# EAGLE design UnknownSchematic (EAGLE 7.6.0)

## Sheet 1 of 3
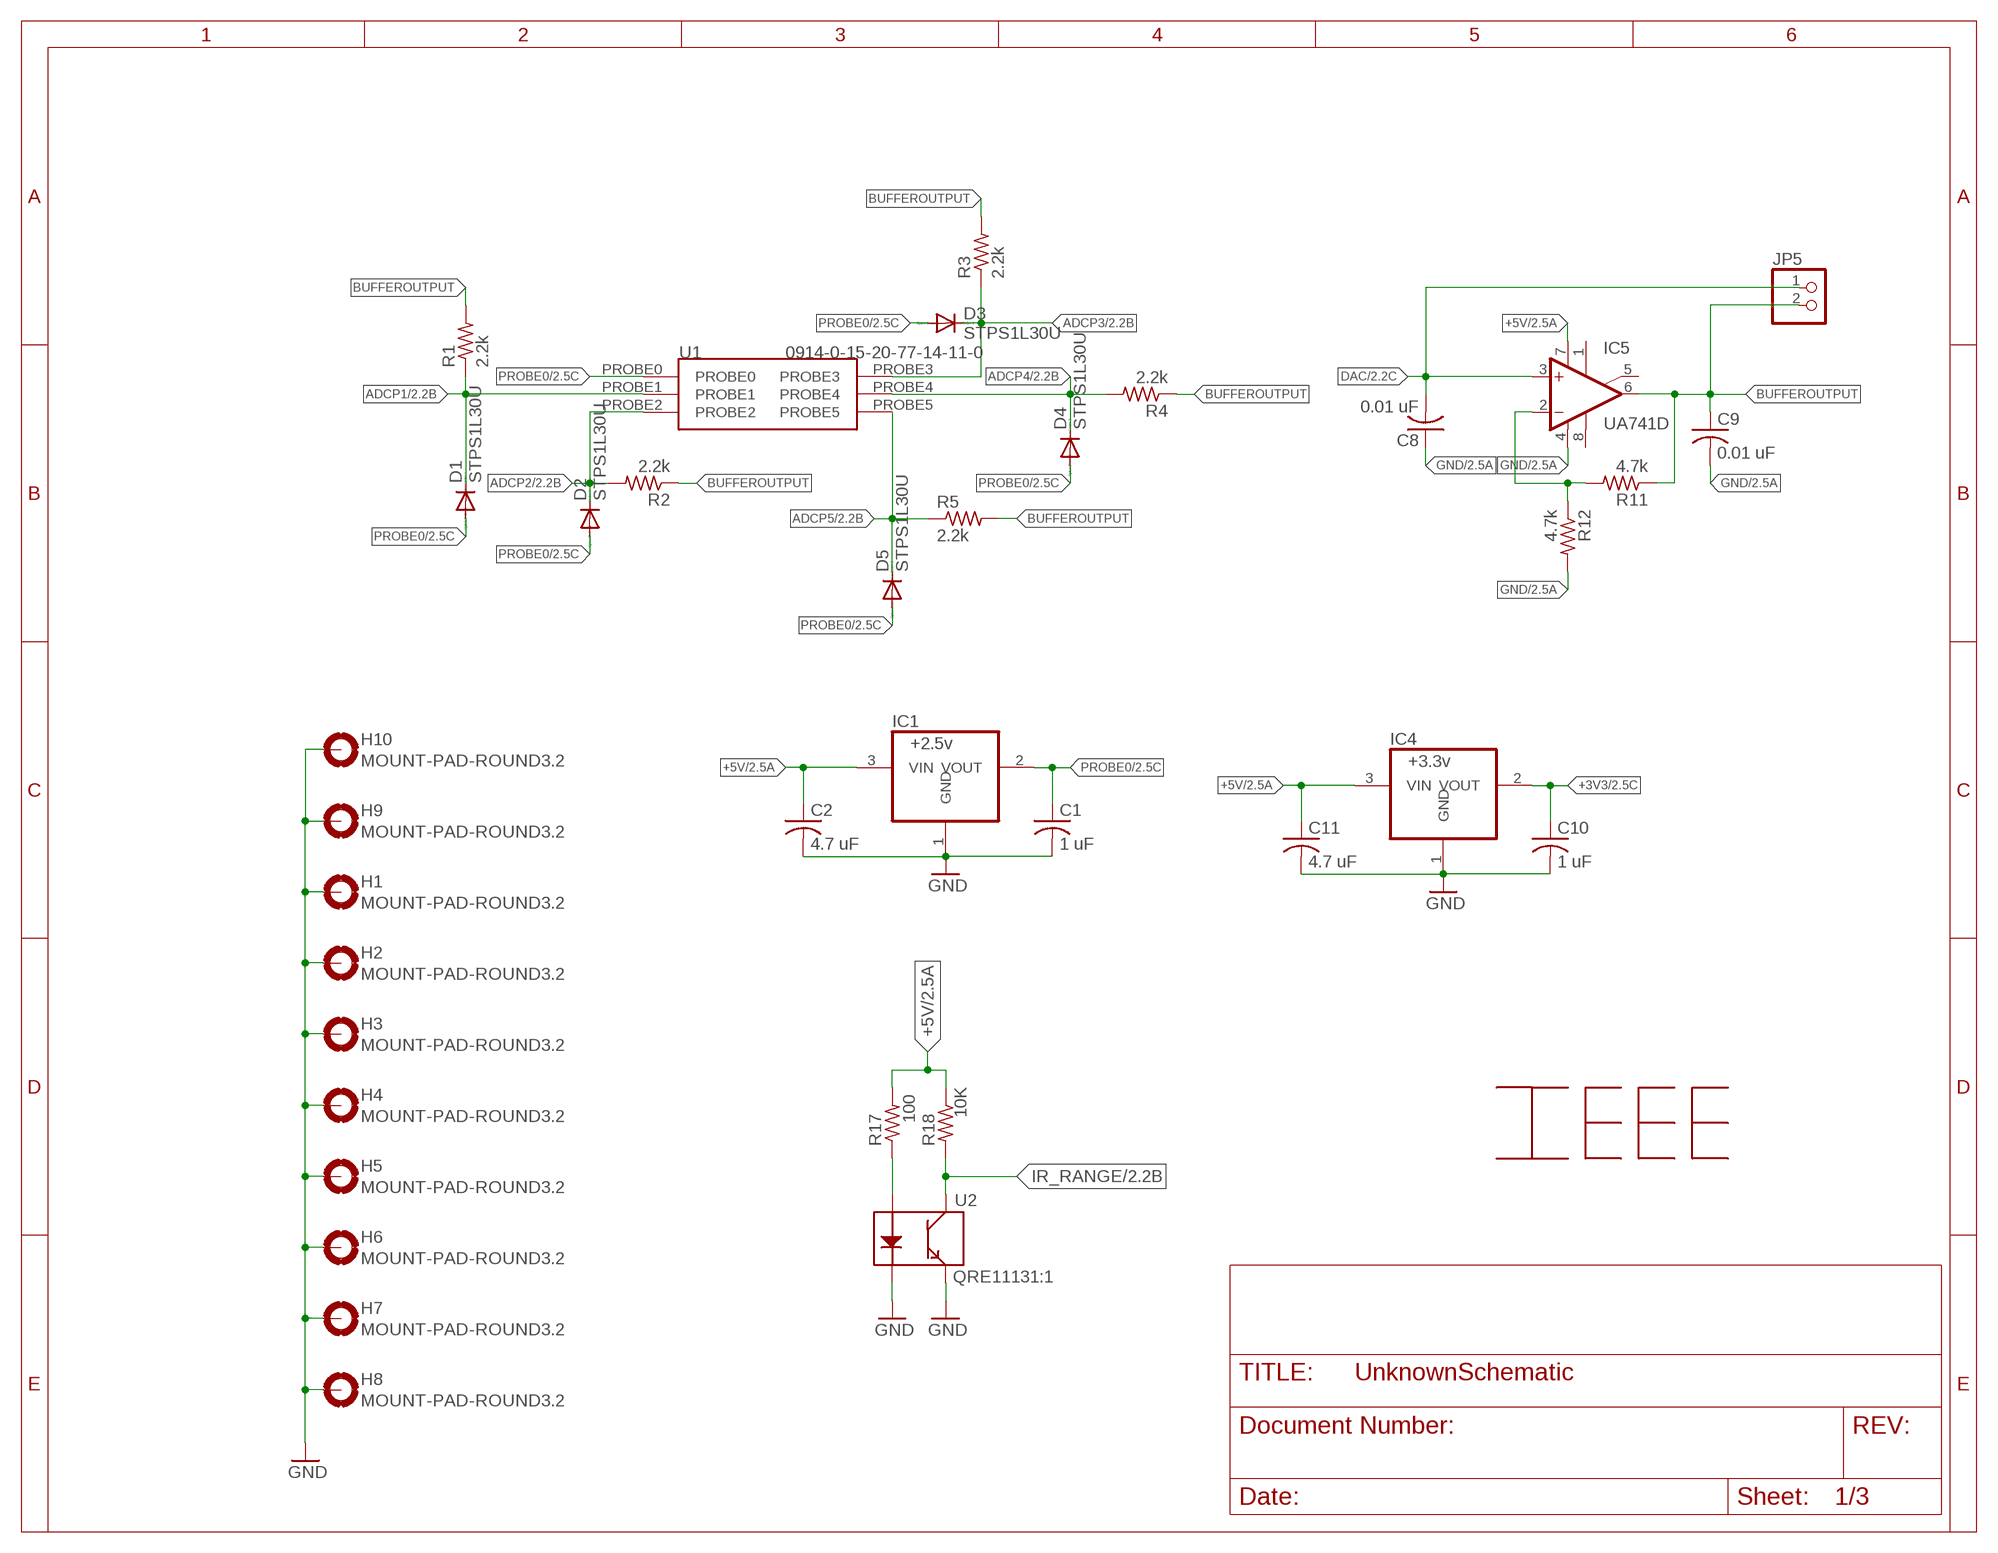
[diagram p0: schematic, sheet 1]

### Parts
C1  1 uF  C-USC0805  [C0805]
C2  4.7 uF  C-USC0805  [C0805]
C8  0.01 uF  C-USC0805  [C0805]
C9  0.01 uF  C-USC0805  [C0805]
C10  1 uF  C-USC0805  [C0805]
C11  4.7 uF  C-USC0805  [C0805]
D1  STPS1L30U  DIODE-DO214AA  [DO214AA]
D2  STPS1L30U  DIODE-DO214AA  [DO214AA]
D3  STPS1L30U  DIODE-DO214AA  [DO214AA]
D4  STPS1L30U  DIODE-DO214AA  [DO214AA]
D5  STPS1L30U  DIODE-DO214AA  [DO214AA]
H1  MOUNT-PAD-ROUND3.2  [3,2-PAD]
H2  MOUNT-PAD-ROUND3.2  [3,2-PAD]
H3  MOUNT-PAD-ROUND3.2  [3,2-PAD]
H4  MOUNT-PAD-ROUND3.2  [3,2-PAD]
H5  MOUNT-PAD-ROUND3.2  [3,2-PAD]
H6  MOUNT-PAD-ROUND3.2  [3,2-PAD]
H7  MOUNT-PAD-ROUND3.2  [3,2-PAD]
H8  MOUNT-PAD-ROUND3.2  [3,2-PAD]
H9  MOUNT-PAD-ROUND3.2  [3,2-PAD]
H10  MOUNT-PAD-ROUND3.2  [3,2-PAD]
IC1  +2.5v  REG1117  [SOT223]
IC4  +3.3v  REG1117  [SOT223]
IC5  UA741D  [SO08]
JP5  PINHD-1X2  [1X02]
R1  2.2k  R-US_R0805  [R0805]
R2  2.2k  R-US_R0805  [R0805]
R3  2.2k  R-US_R0805  [R0805]
R4  2.2k  R-US_R0805  [R0805]
R5  2.2k  R-US_R0805  [R0805]
R11  4.7k  R-US_R0805  [R0805]
R12  4.7k  R-US_R0805  [R0805]
R17  100  R-US_R0805  [R0805]
R18  10K  R-US_R0805  [R0805]
U1  0914-0-15-20-77-14-11-0  STAGE1PROBEMOUNT  [HOLE]
U2  QRE11131:1  [QRE1113-1:1]
U$1  LOGO  [IEEE-LOGO]

### Nets
+3V3: C10.1 IC4.2(VOUT) ; also sheet 2,3
+5V: C2.1 C11.1 IC1.3(VIN) IC4.3(VIN) IC5.7(V+) R17.2 R18.1 ; also sheet 2,3
ADCP1: D1.C R1.1 U1.PROBE1 ; also sheet 2
ADCP2: D2.C R2.2 U1.PROBE2 ; also sheet 2
ADCP3: D3.C R3.1 U1.PROBE3 ; also sheet 2
ADCP4: D4.C R4.2 U1.PROBE4 ; also sheet 2
ADCP5: D5.C R5.1 U1.PROBE5 ; also sheet 2
BUFFEROUTPUT: C9.1 IC5.6(OUT) JP5.2 R1.2 R2.1 R3.2 R4.1 R5.2 R11.1
DAC: C8.2 IC5.3(+IN) JP5.1 ; also sheet 2
GND: C1.2 C2.2 C8.1 C9.2 C10.2 C11.2 H1.B3,2(MOUNT) H2.B3,2(MOUNT) H3.B3,2(MOUNT) H4.B3,2(MOUNT) H5.B3,2(MOUNT) H6.B3,2(MOUNT) H7.B3,2(MOUNT) H8.B3,2(MOUNT) H9.B3,2(MOUNT) H10.B3,2(MOUNT) IC1.1(GND) IC4.1(GND) IC5.4(V-) R12.2 U2.2(K) U2.4(E) ; also sheet 2,3
IR_RANGE: R18.2 U2.3(C) ; also sheet 2
N$2: IC5.2(-IN) R11.2 R12.1
N$12: R17.1 U2.1(A)
PROBE0: C1.1 D1.A D2.A D3.A D4.A D5.A IC1.2(VOUT) U1.PROBE0 ; also sheet 2
Unconnected: IC5.1(ON1) IC5.5(ON2) IC5.8(OPT)

## Sheet 2 of 3
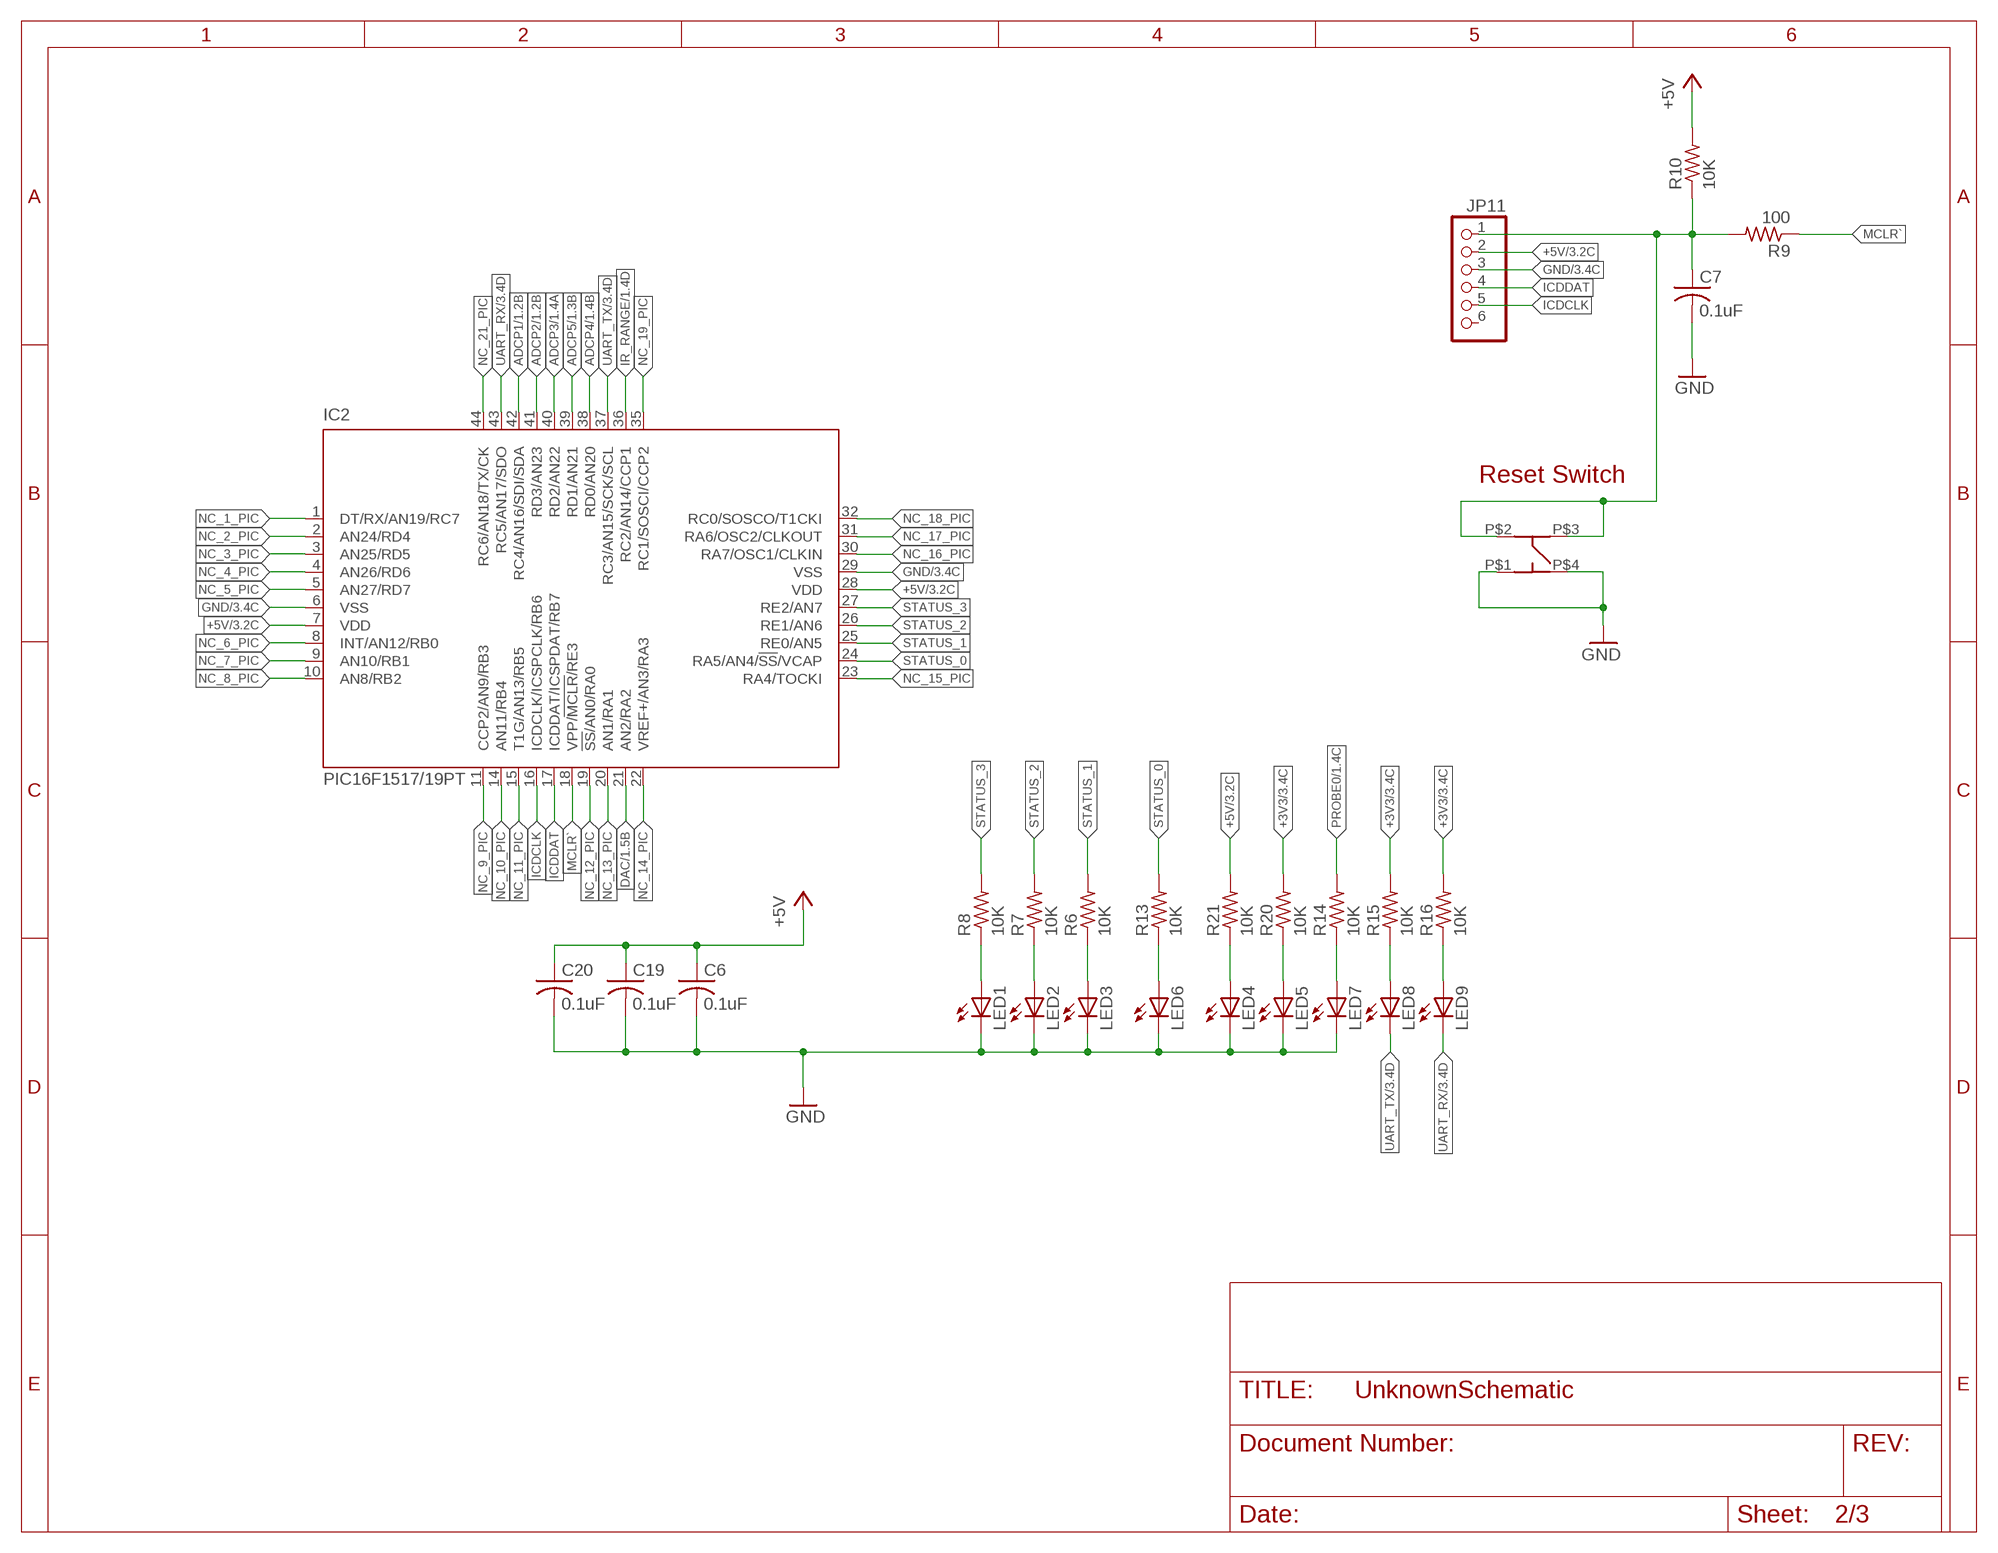
[diagram p1: schematic, sheet 2]

### Parts
C6  0.1uF  C-USC0805  [C0805]
C7  0.1uF  C-USC0805  [C0805]
C19  0.1uF  C-USC0805  [C0805]
C20  0.1uF  C-USC0805  [C0805]
IC2  PIC16F1517/19PT  [TQFP44]
JP11  PINHD-1X6/90  [1X06/90]
LED1  LEDSML0603  [SML0603]
LED2  LEDSML0603  [SML0603]
LED3  LEDSML0603  [SML0603]
LED4  LEDSML0603  [SML0603]
LED5  LEDSML0603  [SML0603]
LED6  LEDSML0603  [SML0603]
LED7  LEDSML0603  [SML0603]
LED8  LEDSML0603  [SML0603]
LED9  LEDSML0603  [SML0603]
R6  10K  R-US_R0805  [R0805]
R7  10K  R-US_R0805  [R0805]
R8  10K  R-US_R0805  [R0805]
R9  100  R-US_R1206  [R1206]
R10  10K  R-US_R1206  [R1206]
R13  10K  R-US_R0805  [R0805]
R14  10K  R-US_R0805  [R0805]
R15  10K  R-US_R0805  [R0805]
R16  10K  R-US_R0805  [R0805]
R20  10K  R-US_R0805  [R0805]
R21  10K  R-US_R0805  [R0805]
TOUCH_RESET  RESET  MC32882_SW  [MC32882_FINAL]

### Nets
+3V3: R15.2 R16.2 R20.2 ; also sheet 1,3
+5V: C6.1 C19.1 C20.1 IC2.7(VDD) IC2.28(VDD) JP11.2 R10.2 R21.2 ; also sheet 1,3
ADCP1: IC2.42(RC4/AN16/SDI/SDA) ; also sheet 1
ADCP2: IC2.41(RD3/AN23) ; also sheet 1
ADCP3: IC2.40(RD2/AN22) ; also sheet 1
ADCP4: IC2.38(RD0/AN20) ; also sheet 1
ADCP5: IC2.39(RD1/AN21) ; also sheet 1
DAC: IC2.21(AN2/RA2) ; also sheet 1
GND: C6.2 C7.2 C19.2 C20.2 IC2.6(VSS) IC2.29(VSS) JP11.3 LED1.C LED2.C LED3.C LED4.C LED5.C LED6.C LED7.C TOUCH_RESET.P$1(P1) TOUCH_RESET.P$4(P4) ; also sheet 1,3
ICDCLK: IC2.16(ICDCLK/ICSPCLK/RB6) JP11.5
ICDDAT: IC2.17(ICDDAT/ICSPDAT/RB7) JP11.4
IR_RANGE: IC2.36(RC2/AN14/CCP1) ; also sheet 1
MCLR: C7.1 JP11.1 R9.2 R10.1 TOUCH_RESET.P$2(P2) TOUCH_RESET.P$3(P3)
MCLR`: IC2.18(VPP/!MCLR!/RE3) R9.1
N$1: LED3.A R6.1
N$3: LED6.A R13.1
N$4: LED7.A R14.1
N$5: LED5.A R20.1
N$6: LED2.A R7.1
N$7: LED1.A R8.1
N$8: LED4.A R21.1
N$10: LED8.A R15.1
N$11: LED9.A R16.1
NC_1_PIC: IC2.1(DT/RX/AN19/RC7)
NC_2_PIC: IC2.2(AN24/RD4)
NC_3_PIC: IC2.3(AN25/RD5)
NC_4_PIC: IC2.4(AN26/RD6)
NC_5_PIC: IC2.5(AN27/RD7)
NC_6_PIC: IC2.8(INT/AN12/RB0)
NC_7_PIC: IC2.9(AN10/RB1)
NC_8_PIC: IC2.10(AN8/RB2)
NC_9_PIC: IC2.11(CCP2/AN9/RB3)
NC_10_PIC: IC2.14(AN11/RB4)
NC_11_PIC: IC2.15(T1G/AN13/RB5)
NC_12_PIC: IC2.19(!SS!/AN0/RA0)
NC_13_PIC: IC2.20(AN1/RA1)
NC_14_PIC: IC2.22(VREF+/AN3/RA3)
NC_15_PIC: IC2.23(RA4/TOCKI)
NC_16_PIC: IC2.30(RA7/OSC1/CLKIN)
NC_17_PIC: IC2.31(RA6/OSC2/CLKOUT)
NC_18_PIC: IC2.32(RC0/SOSCO/T1CKI)
NC_19_PIC: IC2.35(RC1/SOSCI/CCP2)
NC_21_PIC: IC2.44(RC6/AN18/TX/CK)
PROBE0: R14.2 ; also sheet 1
STATUS_0: IC2.24(RA5/AN4/!SS!/VCAP) R13.2
STATUS_1: IC2.25(RE0/AN5) R6.2
STATUS_2: IC2.26(RE1/AN6) R7.2
STATUS_3: IC2.27(RE2/AN7) R8.2
UART_RX: IC2.43(RC5/AN17/SDO) LED9.C ; also sheet 3
UART_TX: IC2.37(RC3/AN15/SCK/SCL) LED8.C ; also sheet 3
Unconnected: JP11.6

### Notes on the sheet
- Reset Switch

## Sheet 3 of 3
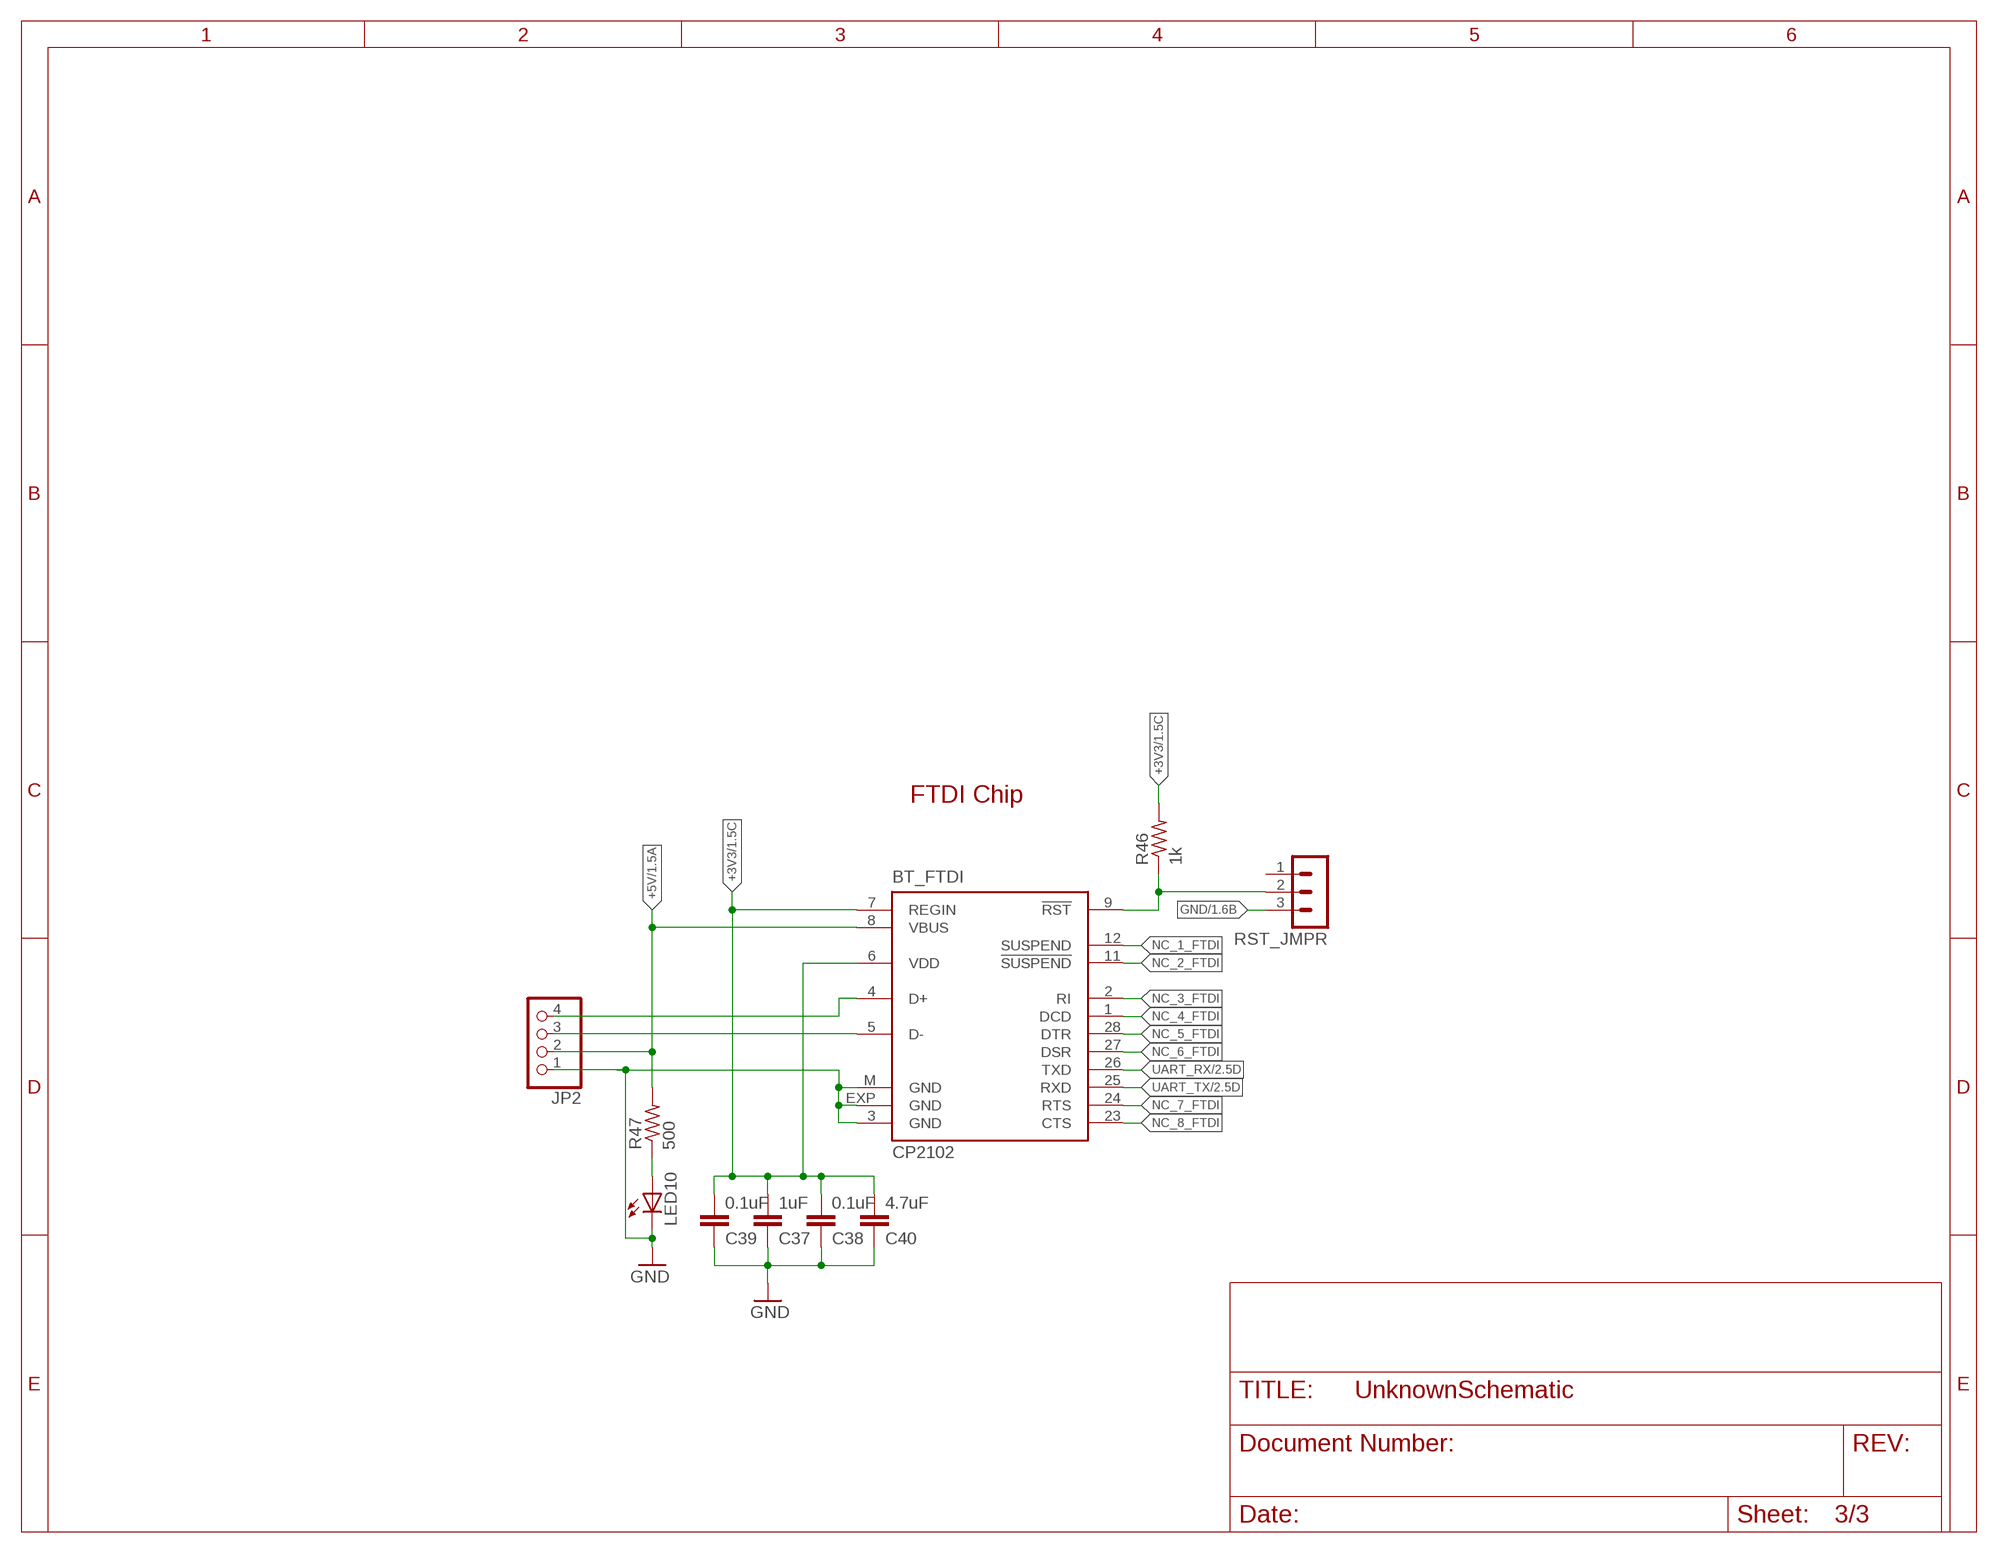
[diagram p2: schematic, sheet 3]

### Parts
BT_FTDI  CP2102  [MLP28]
C37  1uF  C-EUC0805  [C0805]
C38  0.1uF  C-EUC0805  [C0805]
C39  0.1uF  C-EUC0805  [C0805]
C40  4.7uF  C-EUC0805  [C0805]
JP2  PINHD-1X4  [1X04]
LED10  LEDSML0603  [SML0603]
R46  1k  R-US_R0805  [R0805]
R47  500  R-US_R0805  [R0805]
RST_JMPR  MA03-1  [MA03-1]

### Nets
+3V3: BT_FTDI.6(VDD) BT_FTDI.7(REGIN) C37.2 C38.2 C39.2 C40.2 R46.2 ; also sheet 1,2
+5V: BT_FTDI.8(VBUS) JP2.2 R47.2 ; also sheet 1,2
BT_D+: BT_FTDI.4(D+) JP2.4
BT_D-: BT_FTDI.5(D-) JP2.3
GND: BT_FTDI.3(GND) BT_FTDI.EXP(GND) BT_FTDI.M(GND) C37.1 C38.1 C39.1 C40.1 JP2.1 LED10.C RST_JMPR.3 ; also sheet 1,2
N$9: LED10.A R47.1
N$17: BT_FTDI.9(!RST) R46.1 RST_JMPR.2
NC_1_FTDI: BT_FTDI.12(SUSPEND)
NC_2_FTDI: BT_FTDI.11(!SUSPEND)
NC_3_FTDI: BT_FTDI.2(RI)
NC_4_FTDI: BT_FTDI.1(DCD)
NC_5_FTDI: BT_FTDI.28(DTR)
NC_6_FTDI: BT_FTDI.27(DSR)
NC_7_FTDI: BT_FTDI.24(RTS)
NC_8_FTDI: BT_FTDI.23(CTS)
UART_RX: BT_FTDI.26(TXD) ; also sheet 2
UART_TX: BT_FTDI.25(RXD) ; also sheet 2
Unconnected: RST_JMPR.1

### Notes on the sheet
- FTDI Chip

## Library data of the parts
BT_FTDI = silabs:CP210*: Single-Chip USB to UART Bridge Source: www.silabs.com .. CP2101.pdf / cp2102.pdf; MF: FARNELL; MPN: CP2102-GM; OC_FARNELL: 9282130; OC_NEWARK: 30K5635
C1 C2 C6-C11 C19 C20 = rcl:C-US: CAPACITOR, American symbol
C37-C40 = resistor:C-EU: CAPACITOR, European symbol
D1-D5 = diode:DIODE-: DIODE
H1-H10 = holes:MOUNT-PAD-ROUND: MOUNTING PAD, round
IC1 IC4 = burr-brown:REG1117: 800mA and 1A Low Dropout (LDO) Positive Regulator 1.8V, 2.5V, 2.85V, 3.3V, 5V, and Adj; MPN: REG1117; OC_FARNELL: 1097566; OC_NEWARK: 14P6981
IC2 = microchip:PIC16*F1517/19: 28/40/44-Pin Flash Microcontrollers with nanoWatt XLP Technology PIC16F1517/1519 AND PIC16LF1517/1519 Source: www.microchip.com PIC16F1516.pdf
IC5 = linear:*741: OP AMP
JP2 = pinhead:PINHD-1X4: PIN HEADER
JP5 = pinhead:PINHD-1X2: PIN HEADER
JP11 = pinhead:PINHD-1X6: PIN HEADER
LED1-LED10 = interface_board-rev13:LED: LED OSRAM: - CHIPLED LG R971, LG N971, LY N971, LG Q971, LY Q971, LO R971, LY R971 LH N974, LH R974 LS Q976, LO Q976, LY Q976 LO Q996 - Hyper CHIPLED LW Q18S LB Q993, LB Q99A, LB R99A - SideLED LS A670, LO A670, LY A670, LG A670, LP A670 LB A673, LV A673, LT A673, LW A673 LH A674 LY A675 LS A676, LA A676, LO A676, LY A676, LW A676 LS A679, LY A679, LG A679 - Hyper Micro SIDELED® LS Y876, LA Y876, LO Y876, LY Y876 LT Y87S - SmartLED LW L88C, LW L88S LB L89C, LB L89S, LG L890 LS L89K, LO L89K, LY L89K LS L896, LA L896, LO L896, LY L896 - TOPLED LS T670, LO T670, LY T670, LG T670, LP T670 LSG T670, LSP T670, LSY T670, LOP T670, LYG T670 LG T671, LOG T671, LSG T671 LB T673, LV T673, LT T673, LW T673 LH T674 LS T676, LA T676, LO T676, LY T676, LB T676, LH T676, LSB T676, LW T676 LB T67C, LV T67C, LT T67C, LS T67K, LO T67K, LY T67K, LW E67C LS E67B, LA E67B, LO E67B, LY E67B, LB E67C, LV E67C, LT E67C LW T67C LS T679, LY T679, LG T679 LS T770, LO T770, LY T770, LG T770, LP T770 LB T773, LV T773, LT T773, LW T773 LH T774 LS E675, LA E675, LY E675, LS T675 LS T776, LA T776, LO T776, LY T776, LB T776 LHGB T686 LT T68C, LB T68C - Hyper Mini TOPLED® LB M676 - Mini TOPLED Santana® LG M470 LS M47K, LO M47K, LY M47K Source: http://www.osram.convergy.de LUXEON: - LUMILED® LXK2-PW12-R00, LXK2-PW12-S00, LXK2-PW14-U00, LXK2-PW14-V00 LXK2-PM12-R00, LXK2-PM12-S00, LXK2-PM14-U00 LXK2-PE12-Q00, LXK2-PE12-R00, LXK2-PE12-S00, LXK2-PE14-T00, LXK2-PE14-U00 LXK2-PB12-K00, LXK2-PB12-L00, LXK2-PB12-M00, LXK2-PB14-N00, LXK2-PB14-P00, LXK2-PB14-Q00 LXK2-PR12-L00, LXK2-PR12-M00, LXK2-PR14-Q00, LXK2-PR14-R00 LXK2-PD12-Q00, LXK2-PD12-R00, LXK2-PD12-S00 LXK2-PH12-R00, LXK2-PH12-S00 LXK2-PL12-P00, LXK2-PL12-Q00, LXK2-PL12-R00 Source: www.luxeon.com KINGBRIGHT: KA-3528ASYC Source: www.kingbright.com
R1-R18 R20 R21 = rcl:R-US_: RESISTOR, American symbol
R46 R47 = resistor:R-US_: RESISTOR, American symbol
RST_JMPR = con-lstb:MA03-1: PIN HEADER; OC_FARNELL: unknown; OC_NEWARK: unknown
TOUCH_RESET = power_lib:MC32882_SW
U1 = Stage1ProbeMount:STAGE1PROBEMOUNT
U2 = Testing:QRE1113
U$1 = IEEE-logo:LOGO

## Net classes
1 +3V3: width 0.508 mm, drill 0.533 mm, clearance 0.203 mm
3 gnd: width 0.152 mm

## Board
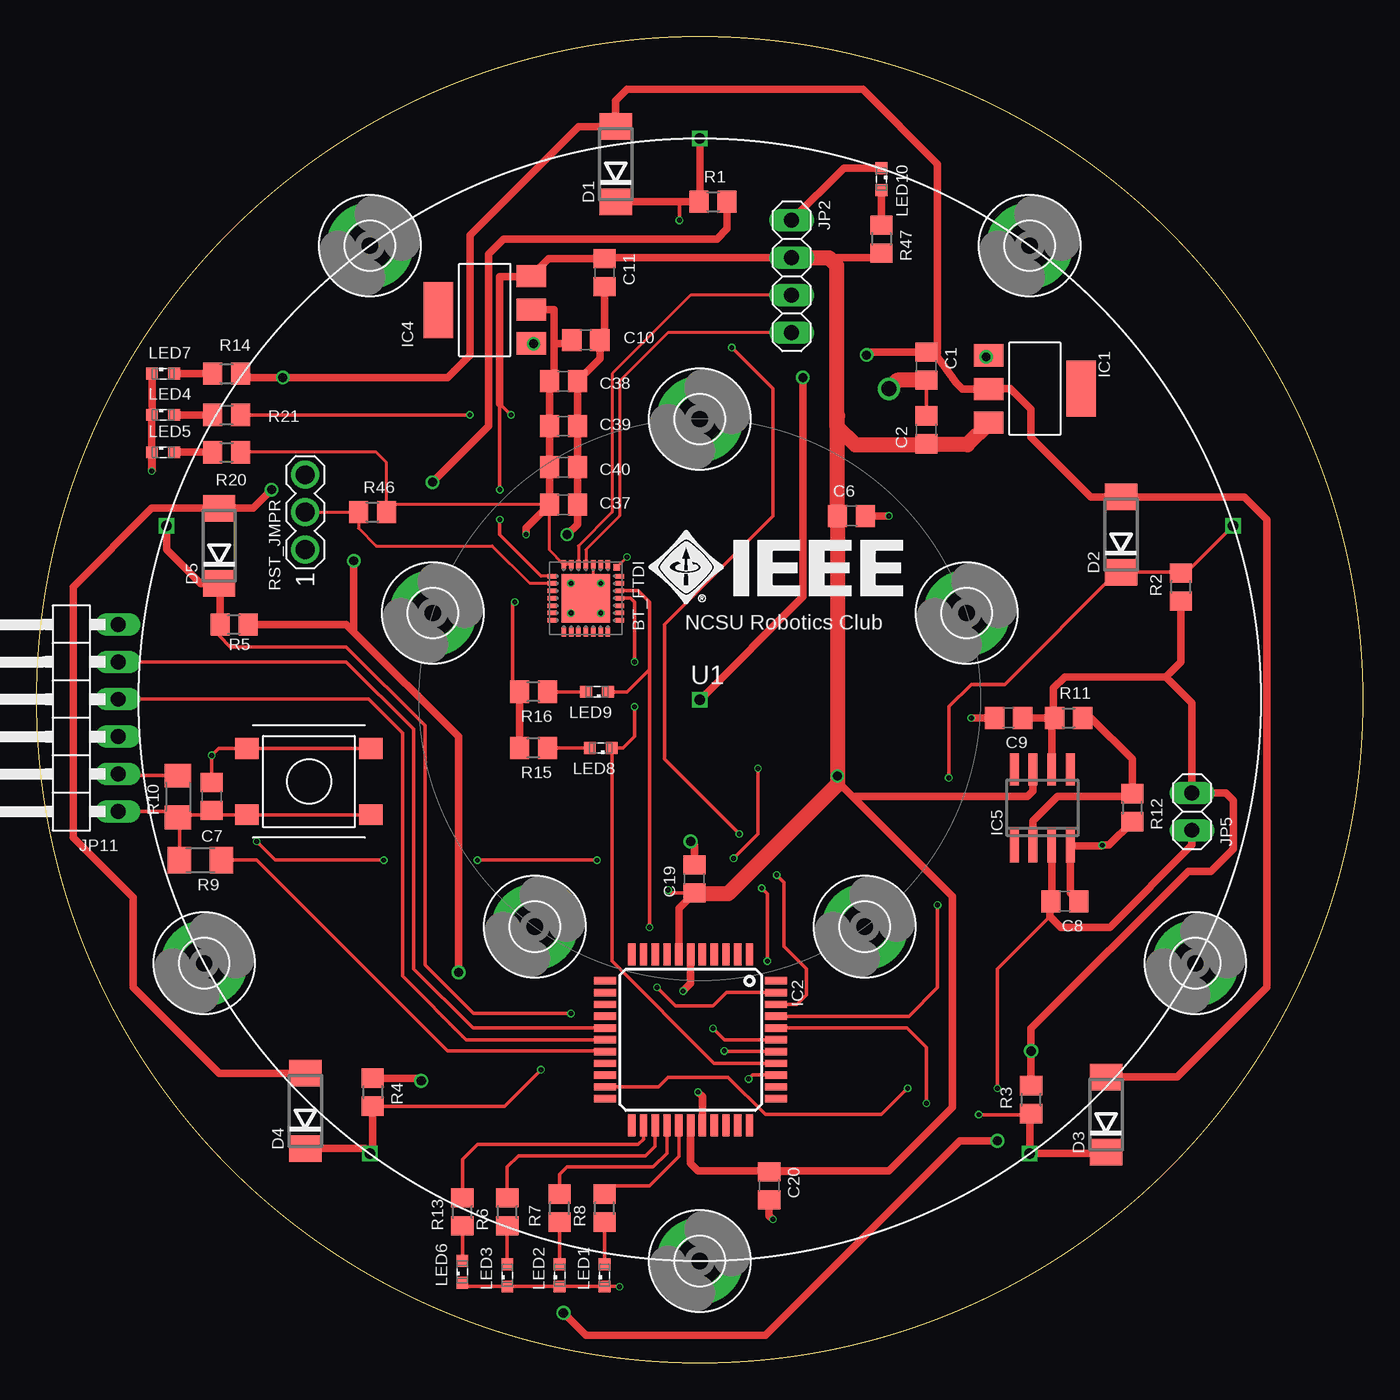
[diagram p3: board, top side]
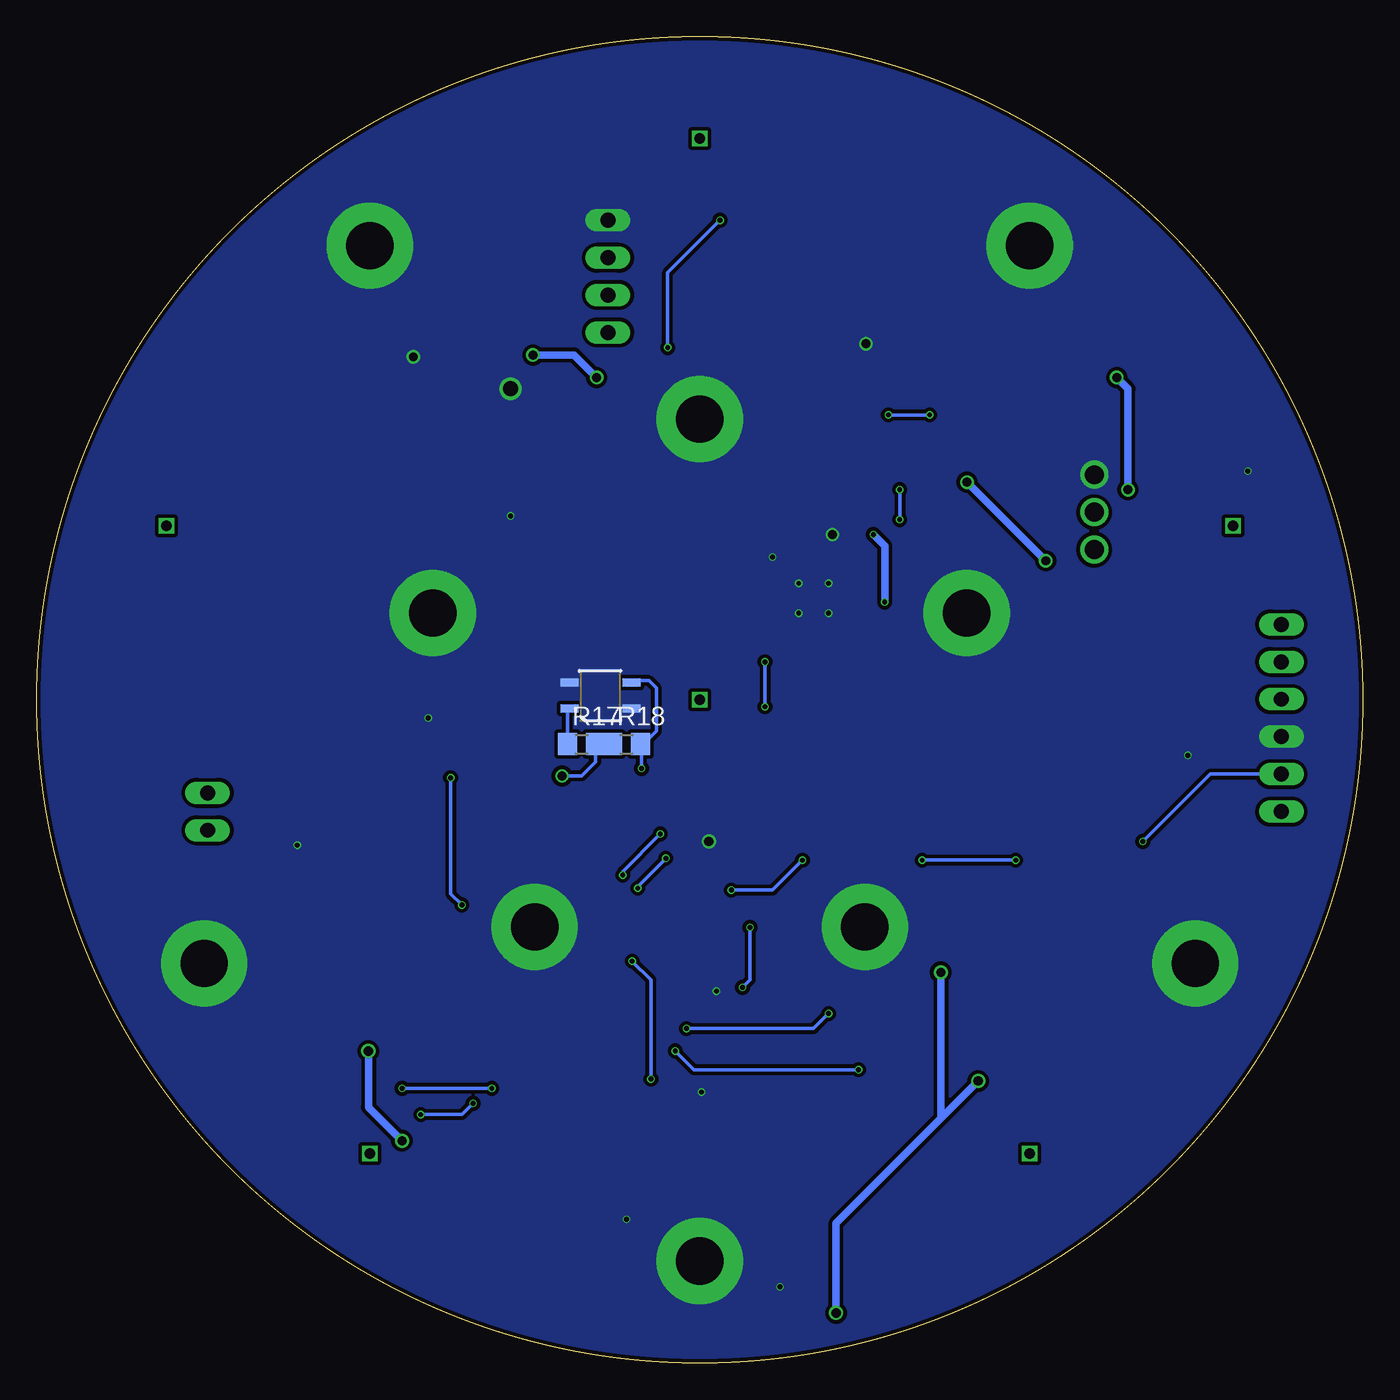
[diagram p4: board, bottom side, seen from below]

Size 90 x 90 mm. Coordinates in mm from the lower left corner, seen from the top.
Outline: circle at 45,45 radius 45
Copper layers (1*16): Top 0.035mm / dielectric 1.5mm / Bottom 0.035mm
Design rules "EagleRules-2-Layer-Shep": minimum track width 6mil, minimum drill 12mil, track to track 6mil, track to pad 6mil, pad to pad 6mil, via to via 6mil, smd to smd 0mil, copper to edge 10mil, drill to drill 10mil, minimum pad ring 2mil, minimum via ring 2mil, stop-mask expansion 2mil, vias tented up to drill 100mil, thermal gap 10mil

### Footprints (pad centres in the part's own frame; a part is rotated, then mirrored left to right if it is on the bottom)
MLP28 = smd 0.6 x 0.3: 1 -2.3,1.5; 2 -2.3,1; 3 -2.3,0.5; 4 -2.3,0; 5 -2.3,-0.5; 6 -2.3,-1; 7 -2.3,-1.5; 15 2.3,-1.5; 16 2.3,-1; 17 2.3,-0.5; 18 2.3,0; 19 2.3,0.5; 20 2.3,1; 21 2.3,1.5 | smd 0.3 x 0.6: 8 -1.5,-2.3; 9 -1,-2.3; 10 -0.5,-2.3; 11 0,-2.3; 12 0.5,-2.3; 13 1,-2.3; 14 1.5,-2.3; 22 1.5,2.3; 23 1,2.3; 24 0.5,2.3; 25 0,2.3; 26 -0.5,2.3; 27 -1,2.3; 28 -1.5,2.3 | smd 3.3 x 3.3: EXP 0,0 | smd 0.435 x 0.435: M -2.103,2.103
C0805 = smd 1.3 x 1.5: 1 -0.95,0; 2 0.95,0
DO214AA = smd 1.8 x 2.2: A 2.55,0; C -2.55,0
3,2-PAD = drill 3.2 pad 5.842: B3,2 0,0
SOT223 = smd 1.499 x 2.007: 1 -2.261,-3.15; 2 0.025,-3.15; 3 2.311,-3.15 | smd 3.81 x 2.007: 4 0,3.15
TQFP44 = smd 1.5 x 0.5: 1 -5.8,4; 2 -5.8,3.2; 3 -5.8,2.4; 4 -5.8,1.6; 5 -5.8,0.8; 6 -5.8,0; 7 -5.8,-0.8; 8 -5.8,-1.6; 9 -5.8,-2.4; 10 -5.8,-3.2; 11 -5.8,-4; 23 5.8,-4; 24 5.8,-3.2; 25 5.8,-2.4; 26 5.8,-1.6; 27 5.8,-0.8; 28 5.8,0; 29 5.8,0.8; 30 5.8,1.6; 31 5.8,2.4; 32 5.8,3.2; 33 5.8,4 | smd 0.5 x 1.5: 12 -4,-5.8; 13 -3.2,-5.8; 14 -2.4,-5.8; 15 -1.6,-5.8; 16 -0.8,-5.8; 17 0,-5.8; 18 0.8,-5.8; 19 1.6,-5.8; 20 2.4,-5.8; 21 3.2,-5.8; 22 4,-5.8; 34 4,5.8; 35 3.2,5.8; 36 2.4,5.8; 37 1.6,5.8; 38 0.8,5.8; 39 0,5.8; 40 -0.8,5.8; 41 -1.6,5.8; 42 -2.4,5.8; 43 -3.2,5.8; 44 -4,5.8
SO08 = smd 0.6 x 2.2: 1 -1.905,-2.6; 2 -0.635,-2.6; 3 0.635,-2.6; 4 1.905,-2.6; 5 1.905,2.6; 6 0.635,2.6; 7 -0.635,2.6; 8 -1.905,2.6
1X04 = drill 1.016 long: 1 -3.81,0; 2 -1.27,0; 3 1.27,0; 4 3.81,0
1X02 = drill 1.016 long: 1 -1.27,0; 2 1.27,0
1X06/90 = drill 1.016 long: 1 -6.35,-3.81; 2 -3.81,-3.81; 3 -1.27,-3.81; 4 1.27,-3.81; 5 3.81,-3.81; 6 6.35,-3.81
SML0603 = smd 0.8 x 0.8: A 0.75,0; C -0.75,0
R0805 = smd 1.3 x 1.5: 1 -0.95,0; 2 0.95,0
R1206 = smd 1.6 x 1.803: 1 -1.422,0; 2 1.422,0
MA03-1 = drill 1.27: 1 -2.54,0; 2 0,0; 3 2.54,0
MC32882_FINAL = smd 1.6 x 1.4: P$1 -4.2,-2.25; P$2 -4.2,2.25; P$3 4.2,2.25; P$4 4.2,-2.25
HOLE = drill 0.7 square: PROBE0 120,-109; PROBE1 120,-70.9; PROBE2 156.2,-97.2; PROBE3 142.4,-139.8; PROBE4 97.6,-139.8; PROBE5 83.8,-97.2
QRE1113-1:1 = smd 1.219 x 0.533: 1 -2.108,-0.889; 2 2.108,-0.889; 3 2.108,0.889; 4 -2.108,0.889

### Placement (x,y rotation side)
BT_FTDI  37.27,51.89 270 top
C1  60.38,67.64 270 top
C2  60.38,63.32 90 top
C6  55.3,57.48 0 top
C7  11.87,38.43 90 top
C8  69.78,31.32 180 top
C9  65.97,43.76 180 top
C10  37.27,69.42 0 top
C11  38.54,73.99 270 top
C19  44.63,32.84 90 top
C20  49.71,12.01 270 top
C37  35.74,58.24 180 top
C38  35.74,66.62 180 top
C39  35.74,63.58 180 top
C40  35.74,60.78 180 top
D1  39.3,81.36 90 top
D2  73.59,56.21 90 top
D3  72.57,16.84 90 top
D4  18.22,17.09 90 top
D5  12.38,55.45 90 top
H1  45,64.05 0 top
H2  26.88,50.89 0 top
H3  33.8,29.59 0 top
H4  22.61,75.82 0 top
H5  67.39,75.82 0 top
H6  11.36,27.11 0 top
H7  78.64,27.11 0 top
H8  45,6.9 0 top
H9  63.12,50.89 0 top
H10  56.2,29.59 0 top
IC1  67.75,66.12 270 top
IC2  44.38,21.92 270 top
IC4  30.41,71.45 90 top
IC5  68.26,37.67 0 top
JP2  51.24,73.74 270 top
JP5  78.42,37.41 90 top
JP11  1.71,43.76 90 top
LED1  38.54,5.92 90 top
LED2  35.49,5.92 90 top
LED3  31.93,5.92 90 top
LED4  8.57,64.34 0 top
LED5  8.57,61.8 0 top
LED6  28.89,6.17 90 top
LED7  8.57,67.13 0 top
LED8  38.28,41.73 180 top
LED9  38.03,45.54 180 top
LED10  57.33,80.34 270 top
R1  45.9,78.82 0 top
R2  77.65,52.65 90 top
R3  67.49,17.86 90 top
R4  22.79,18.36 270 top
R5  13.39,50.11 0 top
R6  31.93,10.24 90 top
R7  35.49,10.49 90 top
R8  38.54,10.49 90 top
R9  11.11,34.11 180 top
R10  9.58,38.43 90 top
R11  70.03,43.76 0 top
R12  74.35,37.67 270 top
R13  28.89,10.24 90 top
R14  12.88,67.13 0 top
R15  33.71,41.73 180 top
R16  33.71,45.54 180 top
R17  53.02,41.99 0 bottom
R18  49.97,41.99 0 bottom
R20  12.88,61.8 0 top
R21  12.88,64.34 0 top
R46  22.79,57.73 0 top
R47  57.33,76.28 270 top
RST_JMPR  18.22,57.73 90 top
TOUCH_RESET  18.47,39.45 180 top
U1  -75,154 0 top
U2  51.75,45.29 0 bottom
U$1  49.71,53.92 0 top

### Tracks (layer width: path | path; a pad name or v marks a point on that pad's centre or on a via)
+3V3  (via drill 0.33)
  Top 0.203: BT_FTDI.6 BT_FTDI.7 34.79,55.17 C37.2 24.25,58.24 R46.2 23.74,61.1 23.04,61.8 R20.2
  Top 0.254: R16.2 32.29,46.01 32.29,51.49 v32.44,51.64
  Top 0.508: C10.1 36.09,69.19 35.11,69.19 | R15.2 R16.2 | v33.2,56.21 33.2,56.65 C37.2 C40.2 C39.2 C38.2 35.11,66.62 35.11,69.19 | 35.11,69.19 35.11,71.47 IC4.2
  Bottom 0.508: v32.44,51.64 32.44,55.45 v33.2,56.21
+5V  (via drill 0.33, 0.6)
  Top 0.203: BT_FTDI.8 34.24,53.39
  Top 0.254: R10.2 5.62,39.85 JP11.2 | v31.43,59.26 31.43,65.1 v32.19,64.34 | 33.53,73.74 IC4.3 | v31.43,57.23 31.43,56.21 34.24,53.39 | R21.2 v29.39,64.34 | C19.1 43.04,31.89 v42.86,32.08 | v38.03,34.11 v29.9,34.11 | v23.55,34.11 16.19,34.11 v14.92,35.38
  Top 0.508: JP2.2 38.6,75.01 C11.1 34.74,74.94 IC4.3 | IC2.28 44.38,13.54 44.89,13.03 52.7,13.03 | IC2.7 43.58,30.84 C19.1 | 53.78,75.01 57.01,75.01 R47.2 | IC5.7 67.62,38.81 67.24,38.43 55.37,38.43 | 55.37,38.43 54.35,39.45 | 52.7,13.03 C20.1 | 52.7,13.03 57.84,13.03 62.16,17.35 62.16,31.64 55.37,38.43 | 33.53,73.74 31.43,73.74 31.43,65.1
  Top 1.016: JP2.2 53.78,75.01 54.29,74.5 54.29,64.34 | 54.29,64.34 54.29,63.58 55.56,62.31 60.32,62.31 C2.1 60.45,62.31 63.18,62.31 64.6,63.73 IC1.3 | 54.29,64.34 54.35,64.27 C6.1 v54.35,39.83 54.35,39.45 54.35,39.26 46.92,31.83 44.7,31.83 C19.1
  Bottom 0.254: v31.43,59.26 v31.43,57.23 | v29.39,64.34 v32.19,64.34 | v42.86,32.08 40.06,32.08 v38.03,34.11 | v29.9,34.11 v23.55,34.11 | v14.92,35.38 10.34,39.95 JP11.2 | R18.1 R17.2 52.07,40.78 53.02,39.83 v54.35,39.83
ADCP1  (via drill 0.33)
  Top 0.254: v50.22,33.1 50.73,32.59 50.73,28.27 52.25,26.75 52.25,24.97 51.61,24.32 IC2.42 | v47.68,35.89 42.6,40.97 42.6,50.11 49.97,57.48 49.97,66.12 v47.17,68.91 | v43.62,77.55 43.62,78.56 43.87,78.82
  Top 0.508: D1.C 43.87,78.82 R1.1 45,78.86 U1.PROBE1
  Bottom 0.254: v50.22,33.1 50.22,33.35 v47.68,35.89 | v47.17,68.91 47.17,73.99 v43.62,77.55
ADCP2  (via drill 0.33)
  Top 0.254: U1.PROBE2 78,53.6 R2.2 77.6,53.66 D2.C 73.33,53.66 65.72,46.05 63.43,46.05 61.91,44.53 v61.91,39.7 | v61.14,31.06 61.14,25.48 59.19,23.52 IC2.41
  Bottom 0.254: v61.91,39.7 61.91,31.83 v61.14,31.06
ADCP3  (via drill 0.33)
  Top 0.254: 67.4,16.81 63.97,16.81 v63.94,16.84 | v60.38,17.6 60.38,21.41 59.07,22.72 IC2.40 50.22,22.68
  Top 0.508: D3.C 72.07,14.3 71.97,14.2 U1.PROBE3 67.4,16.81 R3.1
  Bottom 0.254: v63.94,16.84 61.14,16.84 v60.38,17.6
ADCP4  (via drill 0.33)
  Top 0.254: R4.2 31.75,17.41 v34.22,19.89 | IC2.38 46.7,21.12 v46.67,21.16
  Top 0.508: D4.C 22.26,14.54 U1.PROBE4 22.79,14.39 R4.2
  Bottom 0.254: v34.22,19.89 45.4,19.89 v46.67,21.16
ADCP5  (via drill 0.33)
  Top 0.254: v36.25,23.7 29.65,23.7 26.35,27 26.35,43.26 21.01,48.59 13.14,48.59 12.38,49.35 12.38,50.05 R5.1 | IC2.39 46.67,21.92 v45.9,22.68
  Top 0.508: U1.PROBE5 8.82,56.78 8.82,55.19 11.12,52.9 D5.C 12.44,52.83 R5.1
  Bottom 0.254: v45.9,22.68 37.27,22.68 v36.25,23.7
BT_D+
  Top 0.203: JP2.4 42.86,69.93 39.55,66.62 39.55,57.48 37.27,55.19 BT_FTDI.4
BT_D-
  Top 0.203: JP2.3 44.38,72.47 39.05,67.13 39.05,57.73 36.76,55.45 BT_FTDI.5
BUFFEROUTPUT  (via drill 0.61, 0.64)
  Top 0.508: IC5.6 68.89,43.57 R11.1 | C9.1 R11.1 | 76.64,46.56 78.42,44.78 JP5.2 80.7,38.68 81.21,38.18 81.21,34.87 79.69,33.35 78.16,33.35 67.49,22.68 v67.49,21.16 R3.2 | 76.64,46.56 69.78,46.56 69.02,45.8 69.02,43.83 R11.1 | R2.1 77.65,47.57 76.64,46.56 | R5.2 21.01,50.11 21.52,49.61 | R1.2 46.85,76.97 46.16,76.28 31.68,76.28 30.66,75.26 30.66,63.58 v26.85,59.77 | 21.52,49.61 28.63,42.49 v28.63,26.49 | v21.52,54.43 21.52,49.61 | v65.21,15.06 62.67,15.06 49.46,1.85 37.27,1.85 v35.74,3.38 | 22.98,19.13 R4.1 25.9,19.31 v26.09,19.13
  Bottom 0.508: v26.85,59.77 v21.52,54.43 | v67.49,21.16 67.49,17.35 v65.21,15.06 | v35.74,3.38 35.74,9.47 29.14,16.08 28.63,16.59 | 28.63,16.59 v26.09,19.13 | v28.63,26.49 28.63,16.59
DAC  (via drill 0.33)
  Top 0.254: IC2.21 42.2,18.72 42.86,19.38 46.92,19.38 49.46,16.84 57.33,16.84 v59.11,18.62 | v65.21,18.62 65.21,26.75 68.76,30.3
  Top 0.508: IC5.3 68.89,31.38 C8.2 68.76,31.25 68.76,30.3 69.53,29.54 72.83,29.54 78.42,35.13 JP5.1
  Bottom 0.254: v59.11,18.62 v65.21,18.62
GND  (via drill 0.33, 0.6, 0.64, 1.02)
  Top 0.203: BT_FTDI.3 37.77,53.42 v38.28,52.91 | v36.25,50.88 BT_FTDI.EXP | BT_FTDI.M v40.06,54.69
  Top 0.254: C7.2 v11.87,41.22 12.34,41.7 TOUCH_RESET.P$4 TOUCH_RESET.P$1 | v39.55,5.16 v39.54,5.17 LED1.C LED2.C LED3.C 29.14,5.17 LED6.C | C1.2 C2.2
  Top 0.508: 38.22,72.72 C11.2 38.54,69.42 C10.2 38.22,68.15 C38.1 C39.1 C40.1 C37.1 36.69,56.91 v36,56.21 | LED10.C 54.78,81.09 JP2.1 | C6.2 v57.84,57.48 | C9.2 v63.43,43.76 | R12.2 72.76,35.13 v72.32,35.13 72.26,35.07 IC5.4 70.16,31.89 C8.1 | LED5.C 7.82,60.54 v7.8,60.53 7.8,64.33 LED4.C LED7.C | C20.2 49.71,9.98 v49.97,9.73 | IC2.29 45.18,18.07 v44.89,18.36 | IC2.6 44.38,25.73 v43.87,25.22 | C19.2 44.63,35.13 v44.38,35.38 | IC4.1 33.71,69.19 v33.71,69.16 | IC1.1 v64.45,68.28
  Top 1.016: C1.2 58.42,66.69 v57.84,66.12
  other vias: 36.25,52.91 38.28,50.88
  pour Bottom (isolate 0.254, rank 6, no thermals): -0.07,97.61 104.83,97.61 104.83,-3.48 -11.75,-3.48 -11.75,89.99 -11.75,97.61
ICDCLK
  Top 0.254: IC2.16 29.61,22.72 25.58,26.75 25.58,43 21.01,47.57 JP11.5
ICDDAT
  Top 0.254: IC2.17 29.14,21.92 24.82,26.24 24.82,42.75 22.54,45.03 JP11.4
IR_RANGE  (via drill 0.33)
  Top 0.254: IC2.36 48.58,19.52 v48.32,19.25 | v49.59,27.25 49.59,31.83 v49.21,32.21 | v47.3,34.24 48.95,35.89 v48.95,40.33
  Bottom 0.254: U2.3 49.51,46.3 48.44,46.3 47.94,45.8 47.94,42.88 48.83,41.99 R18.2 48.95,41.92 v48.95,40.33 | v48.32,19.25 48.32,25.98 v49.59,27.25 | v49.21,32.21 49.21,32.33 v47.3,34.24
MCLR
  Top 0.254: JP11.1 9.18,37.41 R10.1 | 12.12,37.2 TOUCH_RESET.P$3 TOUCH_RESET.P$2 | 12.12,37.2 9.77,37.2 R10.1 | R9.2 9.68,36.3 9.58,36.4 R10.1 | C7.1 11.87,37.45 12.12,37.2
MCLR`
  Top 0.254: R9.1 14.92,34.11 27.87,21.16 38.54,21.16 IC2.18
N$1
  Top 0.254: LED3.A R6.1
N$2
  Top 0.508: R11.2 71.56,43.76 74.35,40.97 R12.1 74.16,38.43 69.27,38.43 67.62,36.78 IC5.2
N$3
  Top 0.254: LED6.A R13.1
N$4
  Top 0.508: LED7.A R14.1
N$5
  Top 0.508: R20.1 LED5.A
N$6
  Top 0.254: LED2.A R7.1
N$7
  Top 0.254: LED1.A R8.1
N$8
  Top 0.508: LED4.A R21.1
N$9
  Top 0.508: R47.1 LED10.A
N$10
  Top 0.254: R15.1 LED8.A
N$11
  Top 0.254: R16.1 LED9.A
N$12
  Bottom 0.254: R17.1 53.97,44.29 U2.1
N$17
  Top 0.203: RST_JMPR.2 R46.1 21.84,56.65 23.04,55.45 30.92,55.45 33.46,52.91 34.95,52.91 BT_FTDI.9
PROBE0  (via drill 0.61)
  Top 0.508: D3.A 77.41,19.39 83.5,25.48 83.5,57.23 81.97,58.75 D2.A 71.56,58.75 67.49,62.81 67.49,64.72 66.1,66.12 64.62,66.12 IC1.2 62.82,66.09 62.41,66.5 60.89,68.59 61.14,68.84 61.14,81.36 56.06,86.44 40.06,86.44 39.3,85.67 D1.A 36.77,83.91 29.39,76.53 29.39,68.4 27.87,66.88 v16.69,66.88 14.56,66.88 R14.2 | v15.93,59.26 14.67,58 D5.A 7.81,58 2.47,52.65 2.47,35.64 6.53,31.57 6.53,25.48 12.38,19.63 18.21,19.63 D4.A | U1.PROBE0 52,52 v52,66.88 | v56.32,68.4 56.51,68.59 C1.1
  Top 1.016: C1.1 60.89,68.59
  Bottom 0.508: v15.93,59.26 15.93,66.12 v16.69,66.88 | v52,66.88 53.52,68.4 v56.32,68.4
STATUS_0
  Top 0.254: IC2.24 41.18,15.16 40.82,14.81 29.9,14.81 28.89,13.79 R13.2
STATUS_1
  Top 0.254: IC2.25 41.98,14.69 41.33,14.05 32.7,14.05 31.93,13.28 R6.2
STATUS_2
  Top 0.254: IC2.26 42.78,14.22 41.84,13.28 36,13.28 35.49,12.78 R7.2
STATUS_3
  Top 0.254: IC2.27 43.58,14.01 41.59,12.01 38.64,12.01 R8.2
UART_RX  (via drill 0.33)
  Top 0.254: LED9.C 40.06,45.54 41.59,47.07 | BT_FTDI.26 40.82,52.4 41.59,51.64 41.59,47.07 | 41.59,47.07 v41.59,29.54 | v42.09,25.48 43.36,24.21 45.9,24.21 46.82,25.12 IC2.43
  Bottom 0.254: v41.59,29.54 41.59,25.98 v42.09,25.48
UART_TX  (via drill 0.33)
  Top 0.254: BT_FTDI.25 40.32,51.89 40.57,51.64 v40.57,47.57 | v40.57,44.53 40.57,42.49 39.81,41.73 LED8.C 39.03,27.27 45.98,20.32 IC2.37
  Bottom 0.254: v40.57,47.57 v40.57,44.53

### Text on the board
tPlace: NCSU Robotics Club